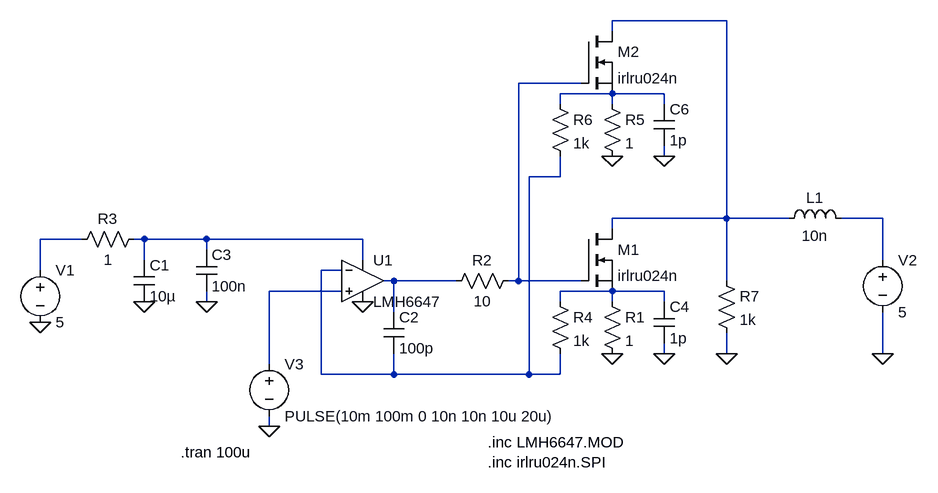
[diagram p0: schematic compactActiveLoad.asc]
compactActiveLoad.asc, the LTspice schematic file:
Version 4
SHEET 1 1004 680
WIRE 704 -320 528 -320
WIRE 528 -304 528 -320
WIRE 480 -224 384 -224
WIRE 528 -208 448 -208
WIRE 608 -208 528 -208
WIRE 448 -192 448 -208
WIRE 528 -192 528 -208
WIRE 608 -192 608 -208
WIRE 608 -112 608 -128
WIRE 448 -80 448 -112
WIRE 448 -80 400 -80
WIRE 704 -16 704 -320
WIRE 704 -16 528 -16
WIRE 800 -16 704 -16
WIRE 944 -16 880 -16
WIRE 528 0 528 -16
WIRE -288 16 -352 16
WIRE -192 16 -208 16
WIRE -96 16 -192 16
WIRE 144 16 -96 16
WIRE -96 32 -96 16
WIRE -192 48 -192 16
WIRE 144 48 144 16
WIRE 944 48 944 -16
WIRE -352 64 -352 16
WIRE 112 64 80 64
WIRE 192 80 176 80
WIRE 288 80 192 80
WIRE 384 80 384 -224
WIRE 384 80 368 80
WIRE 480 80 384 80
WIRE 704 80 704 -16
WIRE 112 96 0 96
WIRE 528 96 448 96
WIRE 608 96 528 96
WIRE -96 112 -96 96
WIRE 448 112 448 96
WIRE 528 112 528 96
WIRE 608 112 608 96
WIRE 192 128 192 80
WIRE 608 192 608 176
WIRE 704 192 704 160
WIRE 944 192 944 128
WIRE 0 208 0 96
WIRE 80 224 80 64
WIRE 192 224 192 192
WIRE 192 224 80 224
WIRE 400 224 400 -80
WIRE 400 224 192 224
WIRE 448 224 448 192
WIRE 448 224 400 224
WIRE 0 304 0 288
FLAG 528 192 0
FLAG 144 112 0
FLAG -352 144 0
FLAG -192 112 0
FLAG 944 192 0
FLAG 0 304 0
FLAG -96 112 0
FLAG 608 192 0
FLAG 704 192 0
FLAG 528 -112 0
FLAG 608 -112 0
SYMBOL Opamps\\opamp2 144 16 R0
SYMATTR InstName U1
SYMATTR Value LMH6647
SYMBOL nmos 480 0 R0
SYMATTR InstName M1
SYMATTR Value irlru024n
SYMATTR Prefix X
SYMBOL res 512 96 R0
SYMATTR InstName R1
SYMATTR Value 1
SYMBOL res 272 96 R270
WINDOW 0 32 56 VTop 2
WINDOW 3 0 56 VBottom 2
SYMATTR InstName R2
SYMATTR Value 10
SYMBOL voltage -352 48 R0
WINDOW 123 0 0 Left 2
WINDOW 39 0 0 Left 2
SYMATTR InstName V1
SYMATTR Value 5
SYMBOL res -192 0 R90
WINDOW 0 0 56 VBottom 2
WINDOW 3 32 56 VTop 2
SYMATTR InstName R3
SYMATTR Value 1
SYMBOL cap -208 48 R0
SYMATTR InstName C1
SYMATTR Value 10µ
SYMATTR SpiceLine Rser=3
SYMBOL voltage 944 32 R0
WINDOW 123 0 0 Left 2
WINDOW 39 0 0 Left 2
SYMATTR InstName V2
SYMATTR Value 5
SYMBOL voltage 0 192 R0
WINDOW 123 0 0 Left 2
WINDOW 39 0 0 Left 2
SYMATTR InstName V3
SYMATTR Value PULSE(10m 100m 0 10n 10n 10u 20u)
SYMBOL cap 176 128 R0
SYMATTR InstName C2
SYMATTR Value 100p
SYMATTR SpiceLine Rser=1 Lser=1p
SYMBOL cap -112 32 R0
SYMATTR InstName C3
SYMATTR Value 100n
SYMATTR SpiceLine Rser=10m
SYMBOL res 432 96 R0
SYMATTR InstName R4
SYMATTR Value 1k
SYMBOL cap 592 112 R0
SYMATTR InstName C4
SYMATTR Value 1p
SYMBOL ind 784 0 R270
WINDOW 0 32 56 VTop 2
WINDOW 3 5 56 VBottom 2
SYMATTR InstName L1
SYMATTR Value 10n
SYMATTR SpiceLine Rser=10m
SYMBOL nmos 480 -304 R0
SYMATTR InstName M2
SYMATTR Value irlru024n
SYMATTR Prefix X
SYMBOL res 512 -208 R0
SYMATTR InstName R5
SYMATTR Value 1
SYMBOL res 432 -208 R0
SYMATTR InstName R6
SYMATTR Value 1k
SYMBOL cap 592 -192 R0
SYMATTR InstName C6
SYMATTR Value 1p
SYMBOL res 688 64 R0
SYMATTR InstName R7
SYMATTR Value 1k
TEXT 336 328 Left 2 !.inc LMH6647.MOD\n.inc irlru024n.SPI
TEXT -136 344 Left 2 !.tran 100u

The netlist it stands for:
* compactActiveLoad.asc
XU1 N009 N004 N007 0 N008 LMH6647  ; pins In+ In- V+ V- OUT
XM1 N001 N002 N010 irlru024n  ; pins D G S
R1 N010 0 1
R2 N008 N002 10
V1 N006 0 5
R3 N007 N006 1
C1 N007 0 10µ Rser=3
V2 N005 0 5
V3 N009 0 PULSE(10m 100m 0 10n 10n 10u 20u)
C2 N008 N004 100p Rser=1 Lser=1p
C3 N007 0 100n Rser=10m
R4 N010 N004 1k
C4 N010 0 1p
L1 N001 N005 10n Rser=10m
XM2 N001 N002 N003 irlru024n  ; pins D G S
R5 N003 0 1
R6 N003 N004 1k
C6 N003 0 1p
R7 N001 0 1k
.inc LMH6647.MOD
.inc irlru024n.SPI
.tran 100u
.backanno
.end